# EAGLE design TSL45315-Breakout_v11 (EAGLE 7.5.0)
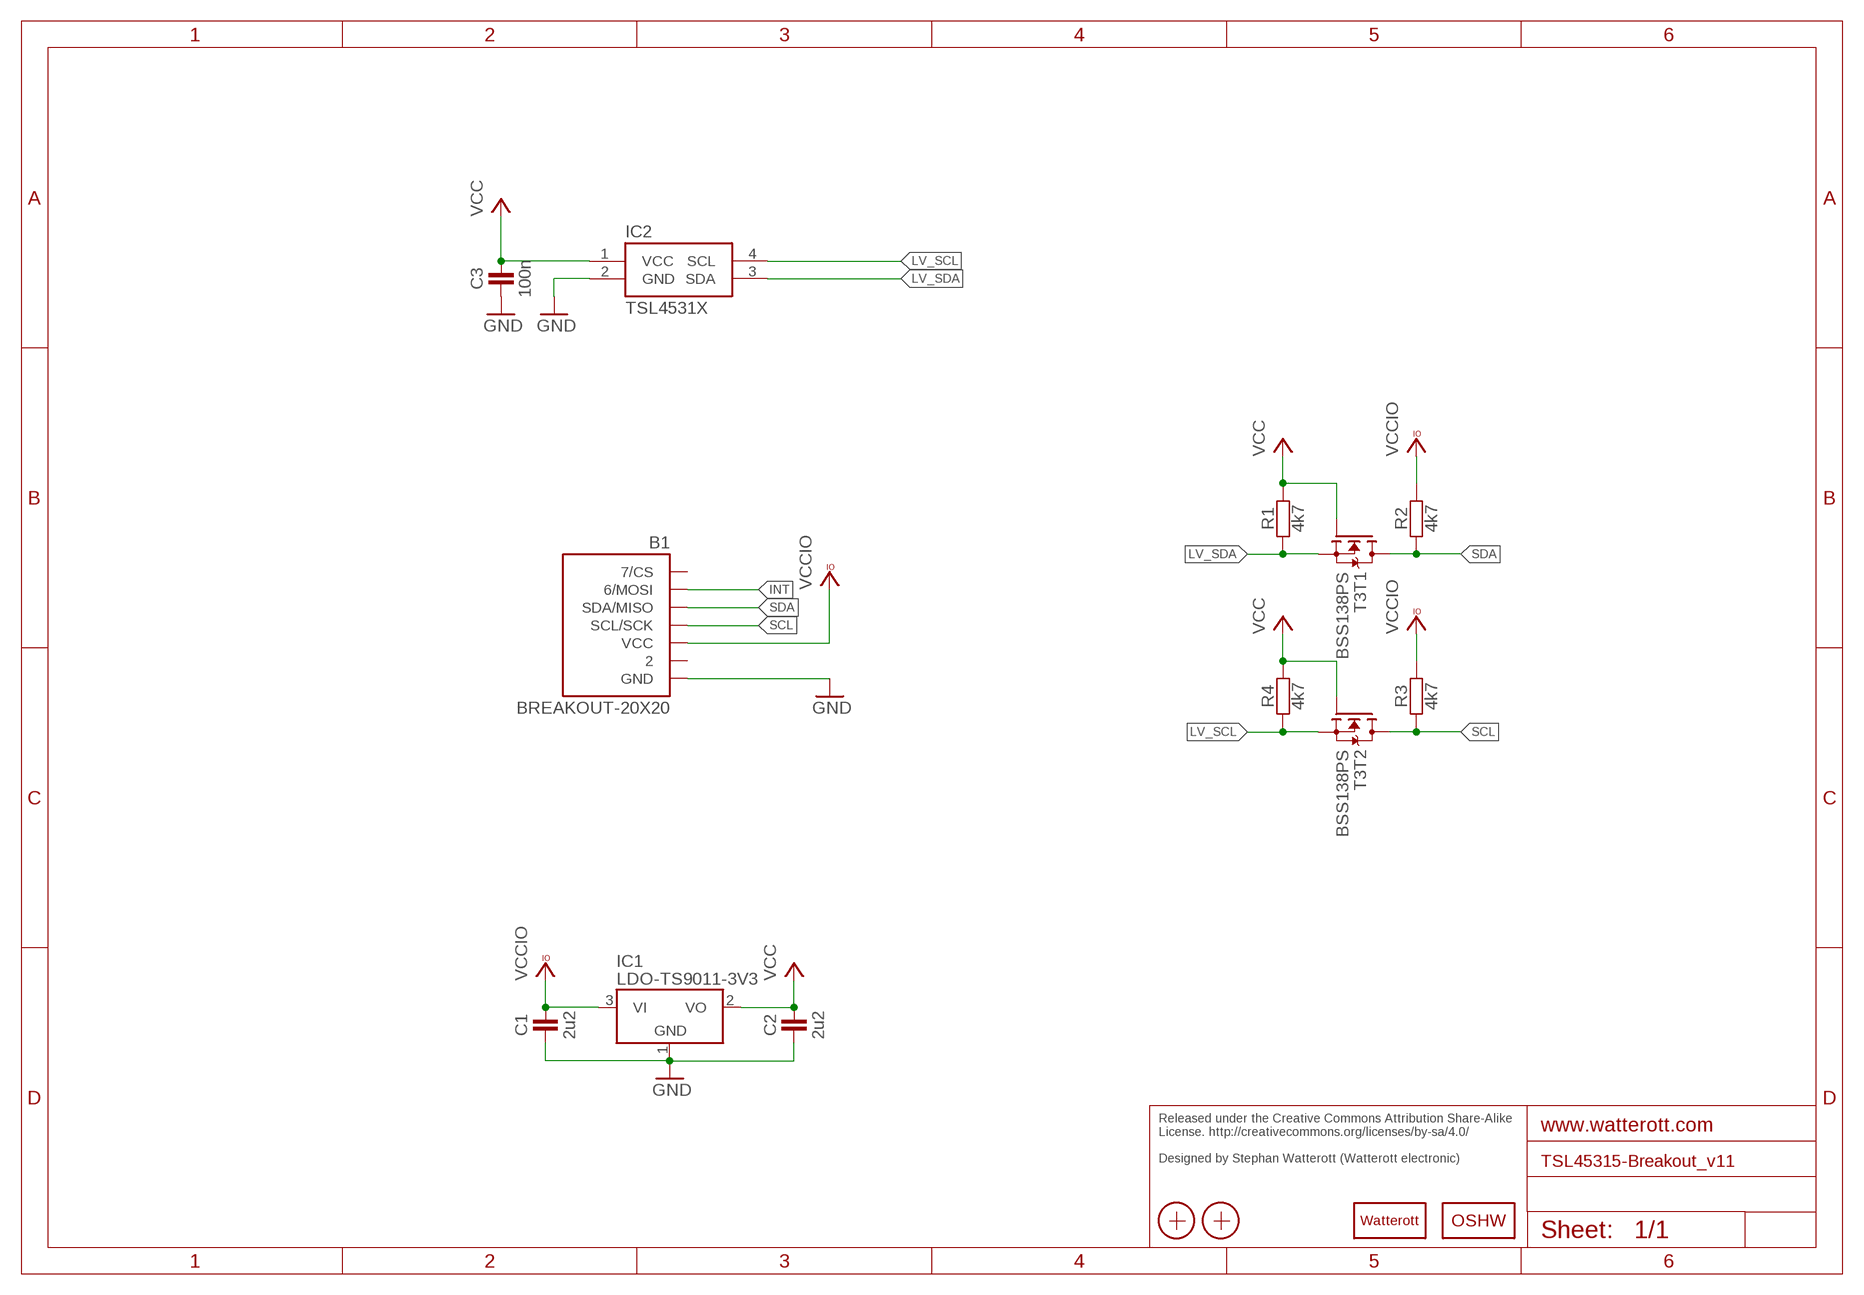
[diagram p0: schematic, sheet 1]

## Parts
B1  BREAKOUT-20X20  [BREAKOUT-20X20]
C1  2u2  CAPACITOR-0402  [C0402]
C2  2u2  CAPACITOR-0402  [C0402]
C3  100n  CAPACITOR-0402  [C0402]
IC1  LDO-TS9011-3V3  [SOT23]
IC2  TSL4531X  [AMS_CL]
LOGO1  LOGO-S_PLACE_M  [SPARK_TPLACE_M]
LOGO2  OSHW_LOGOX0070  [OSHW_6X70]
R1  4k7  RESISTOR-0402  [C0402]
R2  4k7  RESISTOR-0402  [C0402]
R3  4k7  RESISTOR-0402  [C0402]
R4  4k7  RESISTOR-0402  [C0402]
T3  BSS138PS  [SOT363]
X1  PASSER-07  [PASSER_07MM]
X2  PASSER-07  [PASSER_07MM]

## Nets
GND: B1.GND C1.1 C2.1 C3.1 IC1.1(GND) IC2.2(GND)
INT: B1.MOSI(6/MOSI)
LV_SCL: IC2.4(SCL) R4.1 T3.4(T2:S)
LV_SDA: IC2.3(SDA) R1.1 T3.1(T1:S)
SCL: B1.SCL/SCK R3.1 T3.3(T2:D)
SDA: B1.SDA/MISO R2.1 T3.6(T1:D)
VCC: C2.2 C3.2 IC1.2(VO) IC2.1(VCC) R1.2 R4.2 T3.2(T1:G) T3.5(T2:G)
VCCIO: B1.VCC C1.2 IC1.3(VI) R2.2 R3.2
Unconnected: B1.2 B1.CS(7/CS)

## Notes on the sheet
- Released under the Creative Commons Attribution Share-Alike 
  License. http://creativecommons.org/licenses/by-sa/4.0/
  
  Designed by Stephan Watterott (Watterott electronic)

## Library data of the parts
B1 = we-board:BREAKOUT: Breakout Template
C1-C3 = we-rcl:CAPACITOR: Capacitors ...2.2uF @ 6.3V -> 0402 ...4.7uF @ 6.3V -> 0603 ...10uF @ 16V -> 0805 ...22uF @ 25V -> 1206
IC1 = we-power:LDO: LDOs TS1117 800mA, Vin max 12V TS9011 250mA, Vin max 12V - compatible AP2210 300mA, Vin max 15V TS5204 150mA, Vin max 16V
IC2 = we-sensor:TSL4531X: AMS TSL4531 I2C Ambient Light Sensor
LOGO1 = we-symbol:LOGO: Watterott electronic Logo
LOGO2 = we-symbol:OSHW_LOGO: Open-Source-Hardware Logo
R1-R4 = we-rcl:RESISTOR: Resistors all kinds in 0402 and 0603
T3 = we-transistor:BSS138PS: BSS138 Dual N-Channel MOSFET (UGS +/-20V, RDS 1Ohm, ID 320mA)
X1 X2 = we-symbol:PASSER: Fiducial Markers

## Board
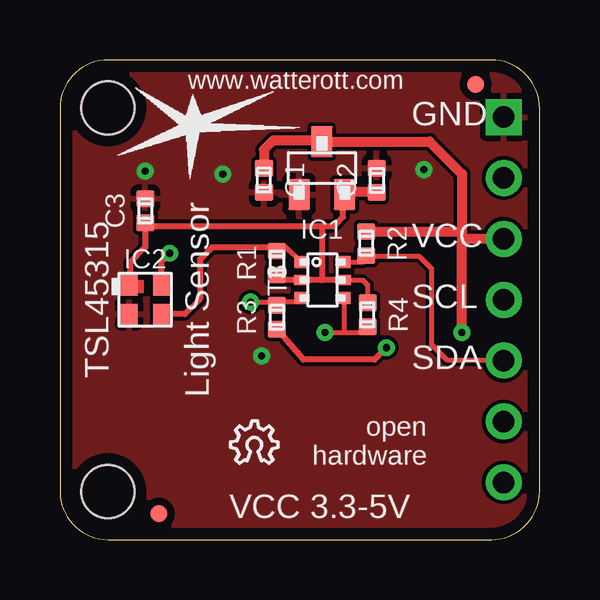
[diagram p1: board, top side]
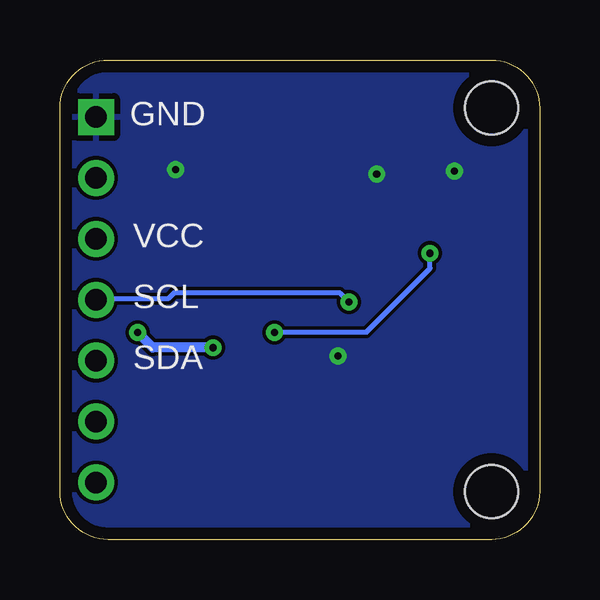
[diagram p2: board, bottom side, seen from below]

Size 20 x 20 mm. Coordinates in mm from the lower left corner, seen from the top.
Copper layers (1*16): Top 0.035mm / dielectric 1.5mm / Bottom 0.035mm
Design rules "we-dru-2-layer": minimum track width 0.15mm, minimum drill 0.3mm, track to track 0.15mm, track to pad 0.15mm, pad to pad 0.15mm, via to via 0.15mm, smd to smd 0.1mm, copper to edge 0.5mm, drill to drill 0.2mm, minimum pad ring 0.18mm, minimum via ring 0.2mm, stop-mask expansion 0.1mm, vias tented up to drill 0.5mm, thermal gap 0.25mm

### Footprints (pad centres in the part's own frame; a part is rotated, then mirrored left to right if it is on the bottom)
BREAKOUT-20X20 = drill 0.9 pad 1.5: 2 18.5,15.08; CS 18.5,2.38; MOSI 18.5,4.92; SCL/SCK 18.5,10; SDA/MISO 18.5,7.46; VCC 18.5,12.54 | drill 0.9 pad 1.5 square: GND 18.5,17.62 | hole 2.2: 2,18; 2,2
C0402 = smd 0.75 x 0.7: 1 0,0.5; 2 0,-0.5
SOT23 = smd 1.3 x 0.9: 1 -1.1,0.95; 2 -1.1,-0.95; 3 1.1,0
AMS_CL = smd 0.7 x 0.85: 1 -0.675,0.6; 2 -0.675,-0.6; 3 0.675,-0.6; 4 0.675,0.6
SOT363 = smd 0.6 x 0.5: 1 -0.9,0.75; 3 -0.9,-0.75; 4 0.9,-0.75; 6 0.9,0.75 | smd 0.6 x 0.4: 2 -0.9,0; 5 0.9,0
PASSER_07MM = smd 0.7 x 0.7: X 0,0

### Placement (x,y rotation side)
B1  0,0 0 top
C1  8.51,14.99 180 top
C2  13.21,14.99 0 top
C3  3.56,13.72 0 top
IC1  10.92,15.49 90 top
IC2  3.56,10 0 top
LOGO1  5.59,17.27 0 top
LOGO2  7.11,3.17 0 top
R1  9.04,11.53 0 top
R2  12.78,12.34 180 top
R3  9.04,9.27 0 top
R4  12.83,9.37 180 top
T3  10.95,10.82 0 top
X1  17.34,18.99 0 top
X2  4.13,1.08 0 top

### Tracks (layer width: path | path; a pad name or v marks a point on that pad's centre or on a via)
GND  (via drill 0.3)
  other vias: 3.56,15.37 8.41,7.66 6.79,15.24 15.18,15.43
  pour Top: -0.13,19.94 20.13,19.94 20.13,-0.13 -0.13,-0.13
  pour Bottom: -0.13,19.94 20.13,19.94 20.13,-0.13 -0.13,-0.13
LV_SCL  (via drill 0.3)
  Top 0.2: v11.05,8.64 11.81,8.64 | 11.81,8.64 12.74,8.64 R4.1 | T3.4 11.85,8.67 11.81,8.64
  Top 0.254: IC2.4 4.23,11.6 v4.57,11.94
  Bottom 0.2: v11.05,8.64 7.24,8.64 4.57,11.3 v4.57,11.94
LV_SDA
  Top 0.2: T3.1 9.44,12.18 R1.1
  Top 0.254: R1.1 9.02,12.06 9.02,12.18 6.34,12.18 5.84,11.68 5.84,10.03 5.21,9.4 IC2.3
SCL  (via drill 0.3)
  Top 0.2: T3.3 9.9,9.92 9.02,9.92 9.02,9.91 R3.1 9.03,9.91 v7.95,9.91
  Bottom 0.2: v7.95,9.91 8.33,10.29 15.24,10.29 15.49,10.03 18.47,10.03 B1.SCL/SCK
SDA
  Top 0.2: T3.6 12.65,11.57 R2.1 12.83,11.81 12.83,11.82 14.98,11.82 15.49,11.3 15.49,8.13 16.13,7.49 18.47,7.49 B1.SDA/MISO
VCC
  Top 0.2: T3.5 12.62,10.82 12.83,10.62 R4.2
  Top 0.254: T3.5 10.92,10.82 | 10.92,10.82 T3.2 9.1,10.82 R1.2 | 3.57,13.08 10.92,13.08 | 11.8,14.34 IC1.2 11.81,14.33 11.81,13.46 11.43,13.08 10.92,13.08 | 10.92,13.08 10.92,10.82 | 3.56,13.08 3.57,13.08 | 3.57,13.08 C3.2 3.56,13.08 | 3.56,13.08 3.56,12.19 2.92,11.56 2.92,10.64 IC2.1
  Top 0.406: C2.2 11.87,14.49 IC1.2
VCCIO  (via drill 0.3)
  Top 0.2: v13.61,8 13.69,8
  Top 0.254: R3.2 10.15,7.51 13.12,7.51 v13.61,8
  Top 0.406: C1.2 8.51,16.26 8.89,16.64 10.62,16.64 IC1.3 15.41,16.59 16.76,15.24 16.76,12.84 | 16.76,12.45 16.76,12.83 16.76,12.84 | v16.76,8.64 16.76,12.45 | B1.VCC 16.86,12.54 16.76,12.45 | R2.2 16.76,12.84
  Bottom 0.2: 13.72,7.9 v13.61,8
  Bottom 0.406: v13.61,8 16.13,8 v16.76,8.64

### Text on the board
tPlace: www.watterott.com | GND | VCC | TSL45315 | Light Sensor | SCL | SDA | open / hardware | VCC 3.3-5V
bPlace: GND | VCC | SCL | SDA